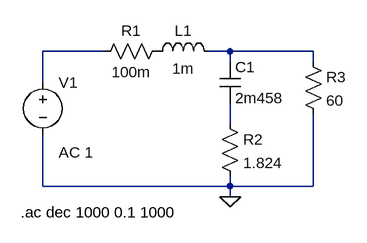
[diagram p0: schematic FilterSomAndenOrdensSystem.asc]
FilterSomAndenOrdensSystem.asc, the LTspice schematic file:
Version 4
SHEET 1 880 680
WIRE 48 112 -48 112
WIRE 240 112 208 112
WIRE 368 112 240 112
WIRE 240 128 240 112
WIRE 368 128 368 112
WIRE -48 160 -48 112
WIRE 240 224 240 192
WIRE -48 320 -48 240
WIRE 240 320 240 304
WIRE 240 320 -48 320
WIRE 368 320 368 208
WIRE 368 320 240 320
WIRE 240 336 240 320
FLAG 240 336 0
SYMBOL voltage -48 144 R0
WINDOW 123 24 124 Left 2
WINDOW 39 0 0 Left 0
SYMATTR InstName V1
SYMATTR Value ""
SYMATTR Value2 AC 1
SYMBOL res 144 96 R90
WINDOW 0 0 56 VBottom 2
WINDOW 3 32 56 VTop 2
SYMATTR InstName R1
SYMATTR Value 100m
SYMBOL ind 112 128 R270
WINDOW 0 32 56 VTop 2
WINDOW 3 5 56 VBottom 2
SYMATTR InstName L1
SYMATTR Value 1m
SYMBOL cap 224 128 R0
SYMATTR InstName C1
SYMATTR Value 2m458
SYMBOL res 224 208 R0
SYMATTR InstName R2
SYMATTR Value 1.824
SYMBOL res 352 112 R0
SYMATTR InstName R3
SYMATTR Value 60
TEXT -82 360 Left 2 !.ac dec 1000 0.1 1000

The netlist it stands for:
* FilterSomAndenOrdensSystem.asc
V1 N001 0 AC 1
R1 P001 N001 100m
L1 P001 N002 1m
C1 N002 N003 2m458
R2 N003 0 1.824
R3 N002 0 60
.ac dec 1000 0.1 1000
.backanno
.end